# Altium schematic sheet key.SchDoc
size A2
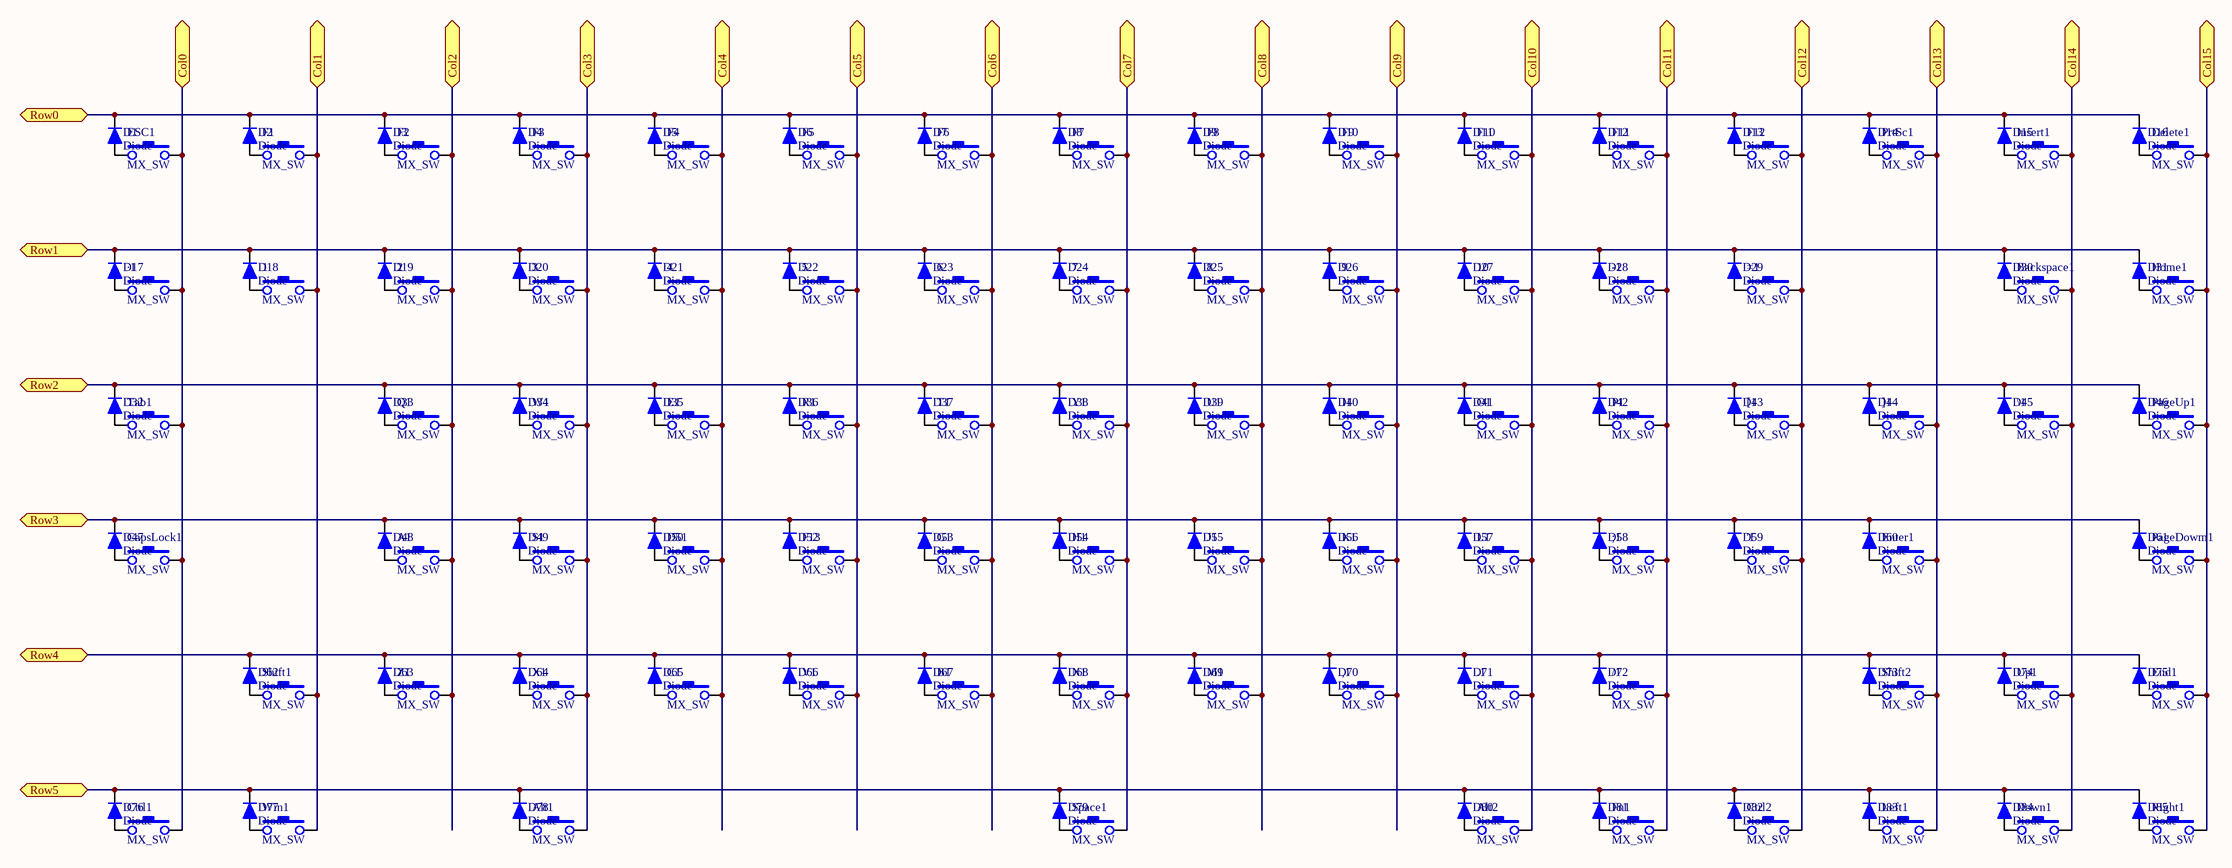
[diagram p0: key.SchDoc]

## Parts
1  MX_SW  [MX_SW-1]
2  MX_SW  [MX_SW-1]
3  MX_SW  [MX_SW-1]
4  MX_SW  [MX_SW-1]
5  MX_SW  [MX_SW-1]
6  MX_SW  [MX_SW-1]
7  MX_SW  [MX_SW-1]
8  MX_SW  [MX_SW-1]
9  MX_SW  [MX_SW-1]
10  MX_SW  [MX_SW-1]
'1  MX_SW  [MX_SW-1]
,1  MX_SW  [MX_SW-1]
-1  MX_SW  [MX_SW-1]
.1  MX_SW  [MX_SW-1]
/1  MX_SW  [MX_SW-1]
;1  MX_SW  [MX_SW-1]
=1  MX_SW  [MX_SW-1]
[1  MX_SW  [MX_SW-1]
\1  MX_SW  [MX_SW-1]
]1  MX_SW  [MX_SW-1]
A1  MX_SW  [MX_SW-1]
Alt1  MX_SW  [MX_SW-1]
Alt2  MX_SW  [MX_SW-1]
B1  MX_SW  [MX_SW-1]
Backspace1  MX_SW  [MX_SW-1]
C1  MX_SW  [MX_SW-1]
CapsLock1  MX_SW  [MX_SW-1]
Ctrl1  MX_SW  [MX_SW-1]
Ctrl2  MX_SW  [MX_SW-1]
D1  Diode  [0805-diode]
D2  Diode  [0805-diode]
D3  Diode  [0805-diode]
D4  Diode  [0805-diode]
D5  Diode  [0805-diode]
D6  Diode  [0805-diode]
D7  Diode  [0805-diode]
D8  Diode  [0805-diode]
D9  Diode  [0805-diode]
D10  Diode  [0805-diode]
D11  Diode  [0805-diode]
D12  Diode  [0805-diode]
D13  Diode  [0805-diode]
D14  Diode  [0805-diode]
D15  Diode  [0805-diode]
D16  Diode  [0805-diode]
D17  Diode  [0805-diode]
D18  Diode  [0805-diode]
D19  Diode  [0805-diode]
D20  Diode  [0805-diode]
D21  Diode  [0805-diode]
D22  Diode  [0805-diode]
D23  Diode  [0805-diode]
D24  Diode  [0805-diode]
D25  Diode  [0805-diode]
D26  Diode  [0805-diode]
D27  Diode  [0805-diode]
D28  Diode  [0805-diode]
D29  Diode  [0805-diode]
D30  Diode  [0805-diode]
D31  Diode  [0805-diode]
D32  Diode  [0805-diode]
D33  Diode  [0805-diode]
D34  Diode  [0805-diode]
D35  Diode  [0805-diode]
D36  Diode  [0805-diode]
D37  Diode  [0805-diode]
D38  Diode  [0805-diode]
D39  Diode  [0805-diode]
D40  Diode  [0805-diode]
D41  Diode  [0805-diode]
D42  Diode  [0805-diode]
D43  Diode  [0805-diode]
D44  Diode  [0805-diode]
D45  Diode  [0805-diode]
D46  Diode  [0805-diode]
D47  Diode  [0805-diode]
D48  Diode  [0805-diode]
D49  Diode  [0805-diode]
D50  Diode  [0805-diode]
D51  MX_SW  [MX_SW-1]
D52  Diode  [0805-diode]
D53  Diode  [0805-diode]
D54  Diode  [0805-diode]
D55  Diode  [0805-diode]
D56  Diode  [0805-diode]
D57  Diode  [0805-diode]
D58  Diode  [0805-diode]
D59  Diode  [0805-diode]
D60  Diode  [0805-diode]
D61  Diode  [0805-diode]
D62  Diode  [0805-diode]
D63  Diode  [0805-diode]
D64  Diode  [0805-diode]
D65  Diode  [0805-diode]
D66  Diode  [0805-diode]
D67  Diode  [0805-diode]
D68  Diode  [0805-diode]
D69  Diode  [0805-diode]
D70  Diode  [0805-diode]
D71  Diode  [0805-diode]
D72  Diode  [0805-diode]
D73  Diode  [0805-diode]
D74  Diode  [0805-diode]
D75  Diode  [0805-diode]
D76  Diode  [0805-diode]
D77  Diode  [0805-diode]
D78  Diode  [0805-diode]
D79  Diode  [0805-diode]
D80  Diode  [0805-diode]
D81  Diode  [0805-diode]
D82  Diode  [0805-diode]
D83  Diode  [0805-diode]
D84  Diode  [0805-diode]
D85  Diode  [0805-diode]
Delete1  MX_SW  [MX_SW-1]
Down1  MX_SW  [MX_SW-1]
E1  MX_SW  [MX_SW-1]
End1  MX_SW  [MX_SW-1]
Enter1  MX_SW  [MX_SW-1]
ESC1  MX_SW  [MX_SW-1]
F1  MX_SW  [MX_SW-1]
F2  MX_SW  [MX_SW-1]
F3  MX_SW  [MX_SW-1]
F4  MX_SW  [MX_SW-1]
F5  MX_SW  [MX_SW-1]
F6  MX_SW  [MX_SW-1]
F7  MX_SW  [MX_SW-1]
F8  MX_SW  [MX_SW-1]
F9  MX_SW  [MX_SW-1]
F10  MX_SW  [MX_SW-1]
F11  MX_SW  [MX_SW-1]
F12  MX_SW  [MX_SW-1]
F13  MX_SW  [MX_SW-1]
Fn1  MX_SW  [MX_SW-1]
G1  MX_SW  [MX_SW-1]
H1  MX_SW  [MX_SW-1]
Home1  MX_SW  [MX_SW-1]
I1  MX_SW  [MX_SW-1]
Insert1  MX_SW  [MX_SW-1]
J1  MX_SW  [MX_SW-1]
K1  MX_SW  [MX_SW-1]
L1  MX_SW  [MX_SW-1]
Left1  MX_SW  [MX_SW-1]
M1  MX_SW  [MX_SW-1]
N1  MX_SW  [MX_SW-1]
O1  MX_SW  [MX_SW-1]
P1  MX_SW  [MX_SW-1]
PageDowm1  MX_SW  [MX_SW-1]
PageUp1  MX_SW  [MX_SW-1]
PrtSc1  MX_SW  [MX_SW-1]
Q1  MX_SW  [MX_SW-1]
R1  MX_SW  [MX_SW-1]
Right1  MX_SW  [MX_SW-1]
S1  MX_SW  [MX_SW-1]
Shift1  MX_SW  [MX_SW-1]
Shift2  MX_SW  [MX_SW-1]
Space1  MX_SW  [MX_SW-1]
T1  MX_SW  [MX_SW-1]
Tab1  MX_SW  [MX_SW-1]
U1  MX_SW  [MX_SW-1]
Up1  MX_SW  [MX_SW-1]
V1  MX_SW  [MX_SW-1]
W1  MX_SW  [MX_SW-1]
Win1  MX_SW  [MX_SW-1]
X1  MX_SW  [MX_SW-1]
Y1  MX_SW  [MX_SW-1]
Z1  MX_SW  [MX_SW-1]
·1  MX_SW  [MX_SW-1]

## Ports
Col0 (bidir), Col1 (bidir), Col2 (bidir), Col3 (bidir), Col4 (bidir), Col5 (bidir), Col6 (bidir), Col7 (bidir), Col8 (bidir), Col9 (bidir), Col10 (bidir), Col11 (bidir), Col12 (bidir), Col13 (bidir), Col14 (bidir), Col15 (bidir), Row0 (bidir), Row1 (bidir), Row2 (bidir), Row3 (bidir), Row4 (bidir), Row5 (bidir)

## Nets
Col0: CapsLock1.2 Ctrl1.2 ESC1.2 Tab1.2 ·1.2 ; port Col0
Col1: 1.2 F1.2 Shift1.2 Win1.2 ; port Col1
Col2: 2.2 A1.2 F2.2 Q1.2 Z1.2 ; port Col2
Col3: 3.2 Alt1.2 F3.2 S1.2 W1.2 X1.2 ; port Col3
Col4: 4.2 C1.2 D51.2 E1.2 F4.2 ; port Col4
Col5: 5.2 F5.2 F13.2 R1.2 V1.2 ; port Col5
Col6: 6.2 B1.2 F6.2 G1.2 T1.2 ; port Col6
Col7: 7.2 F7.2 H1.2 N1.2 Space1.2 Y1.2 ; port Col7
Col8: 8.2 F8.2 J1.2 M1.2 U1.2 ; port Col8
Col9: 9.2 ,1.2 F9.2 I1.2 K1.2 ; port Col9
Col10: 10.2 .1.2 Alt2.2 F10.2 L1.2 O1.2 ; port Col10
Col11: -1.2 /1.2 ;1.2 F11.2 Fn1.2 P1.2 ; port Col11
Col12: '1.2 =1.2 [1.2 Ctrl2.2 F12.2 ; port Col12
Col13: ]1.2 Enter1.2 Left1.2 PrtSc1.2 Shift2.2 ; port Col13
Col14: \1.2 Backspace1.2 Down1.2 Insert1.2 Up1.2 ; port Col14
Col15: Delete1.2 End1.2 Home1.2 PageDowm1.2 PageUp1.2 Right1.2 ; port Col15
Row0: D1.K D2.K D3.K D4.K D5.K D6.K D7.K D8.K D9.K D10.K D11.K D12.K D13.K D14.K D15.K D16.K ; port Row0
Row1: D17.K D18.K D19.K D20.K D21.K D22.K D23.K D24.K D25.K D26.K D27.K D28.K D29.K D30.K D31.K ; port Row1
Row2: D32.K D33.K D34.K D35.K D36.K D37.K D38.K D39.K D40.K D41.K D42.K D43.K D44.K D45.K D46.K ; port Row2
Row3: D47.K D48.K D49.K D50.K D52.K D53.K D54.K D55.K D56.K D57.K D58.K D59.K D60.K D61.K ; port Row3
Row4: D62.K D63.K D64.K D65.K D66.K D67.K D68.K D69.K D70.K D71.K D72.K D73.K D74.K D75.K ; port Row4
Row5: D76.K D77.K D78.K D79.K D80.K D81.K D82.K D83.K D84.K D85.K ; port Row5
Net1_1: 1.1 D18.A
Net2_1: 2.1 D19.A
Net3_1: 3.1 D20.A
Net4_1: 4.1 D21.A
Net5_1: 5.1 D22.A
Net6_1: 6.1 D23.A
Net7_1: 7.1 D24.A
Net8_1: 8.1 D25.A
Net9_1: 9.1 D26.A
Net10_1: 10.1 D27.A
Net'1_1: '1.1 D59.A
Net,1_1: ,1.1 D70.A
Net-1_1: -1.1 D28.A
Net.1_1: .1.1 D71.A
Net/1_1: /1.1 D72.A
Net;1_1: ;1.1 D58.A
Net=1_1: =1.1 D29.A
Net[1_1: [1.1 D43.A
Ne~{t}1_1: \1.1 D45.A
Net]1_1: ]1.1 D44.A
NetA1_1: A1.1 D48.A
NetAlt1_1: Alt1.1 D78.A
NetAlt2_1: Alt2.1 D80.A
NetB1_1: B1.1 D67.A
NetBackspace1_1: Backspace1.1 D30.A
NetC1_1: C1.1 D65.A
NetCapsLock1_1: CapsLock1.1 D47.A
NetCtrl1_1: Ctrl1.1 D76.A
NetCtrl2_1: Ctrl2.1 D82.A
NetD1_A: D1.A ESC1.1
NetD2_A: D2.A F1.1
NetD3_A: D3.A F2.1
NetD4_A: D4.A F3.1
NetD5_A: D5.A F4.1
NetD6_A: D6.A F5.1
NetD7_A: D7.A F6.1
NetD8_A: D8.A F7.1
NetD9_A: D9.A F8.1
NetD10_A: D10.A F9.1
NetD11_A: D11.A F10.1
NetD12_A: D12.A F11.1
NetD13_A: D13.A F12.1
NetD14_A: D14.A PrtSc1.1
NetD15_A: D15.A Insert1.1
NetD16_A: D16.A Delete1.1
NetD17_A: D17.A ·1.1
NetD31_A: D31.A Home1.1
NetD32_A: D32.A Tab1.1
NetD33_A: D33.A Q1.1
NetD34_A: D34.A W1.1
NetD35_A: D35.A E1.1
NetD36_A: D36.A R1.1
NetD37_A: D37.A T1.1
NetD38_A: D38.A Y1.1
NetD39_A: D39.A U1.1
NetD40_A: D40.A I1.1
NetD41_A: D41.A O1.1
NetD42_A: D42.A P1.1
NetD46_A: D46.A PageUp1.1
NetD49_A: D49.A S1.1
NetD50_A: D50.A D51.1
NetD52_A: D52.A F13.1
NetD53_A: D53.A G1.1
NetD54_A: D54.A H1.1
NetD55_A: D55.A J1.1
NetD56_A: D56.A K1.1
NetD57_A: D57.A L1.1
NetD60_A: D60.A Enter1.1
NetD61_A: D61.A PageDowm1.1
NetD62_A: D62.A Shift1.1
NetD63_A: D63.A Z1.1
NetD64_A: D64.A X1.1
NetD66_A: D66.A V1.1
NetD68_A: D68.A N1.1
NetD69_A: D69.A M1.1
NetD73_A: D73.A Shift2.1
NetD74_A: D74.A Up1.1
NetD75_A: D75.A End1.1
NetD77_A: D77.A Win1.1
NetD79_A: D79.A Space1.1
NetD81_A: D81.A Fn1.1
NetD83_A: D83.A Left1.1
NetD84_A: D84.A Down1.1
NetD85_A: D85.A Right1.1

## Notes on the sheet
- Title
- Size:
- Date:
- File:
- A2
- Number:
- Time:
- Revision:
- Sheet
- of

## Library data of the parts
1-10 '1 ,1 -1 .1 /1 ;1 =1 [1 \1 ]1 A1 Alt1 Alt2 B1 Backspace1 C1 CapsLock1 Ctrl1 Ctrl2 D51 Delete1 Down1 E1 End1 Enter1 ESC1 F1-F13 Fn1 G1 H1 Home1 I1 Insert1 J1 K1 L1 Left1 M1 N1 O1 P1 PageDowm1 PageUp1 PrtSc1 Q1 R1 Right1 S1 Shift1 Shift2 Space1 T1 Tab1 U1 Up1 V1 W1 Win1 X1 Y1 Z1 ·1 = MX_SW-1: without Fixation pins  1-Pole